# Altium schematic sheet TOP.SchDoc: TOP.SchDoc
size A4; Organization: Queen's Formula SAE; Address1: 130 Stuart St; Address2: Kingston K7L 2V9; Address3: Ontario; Address4: Canada; DocumentNumber: 1; Revision: 0; SheetNumber: 1; SheetTotal: 1
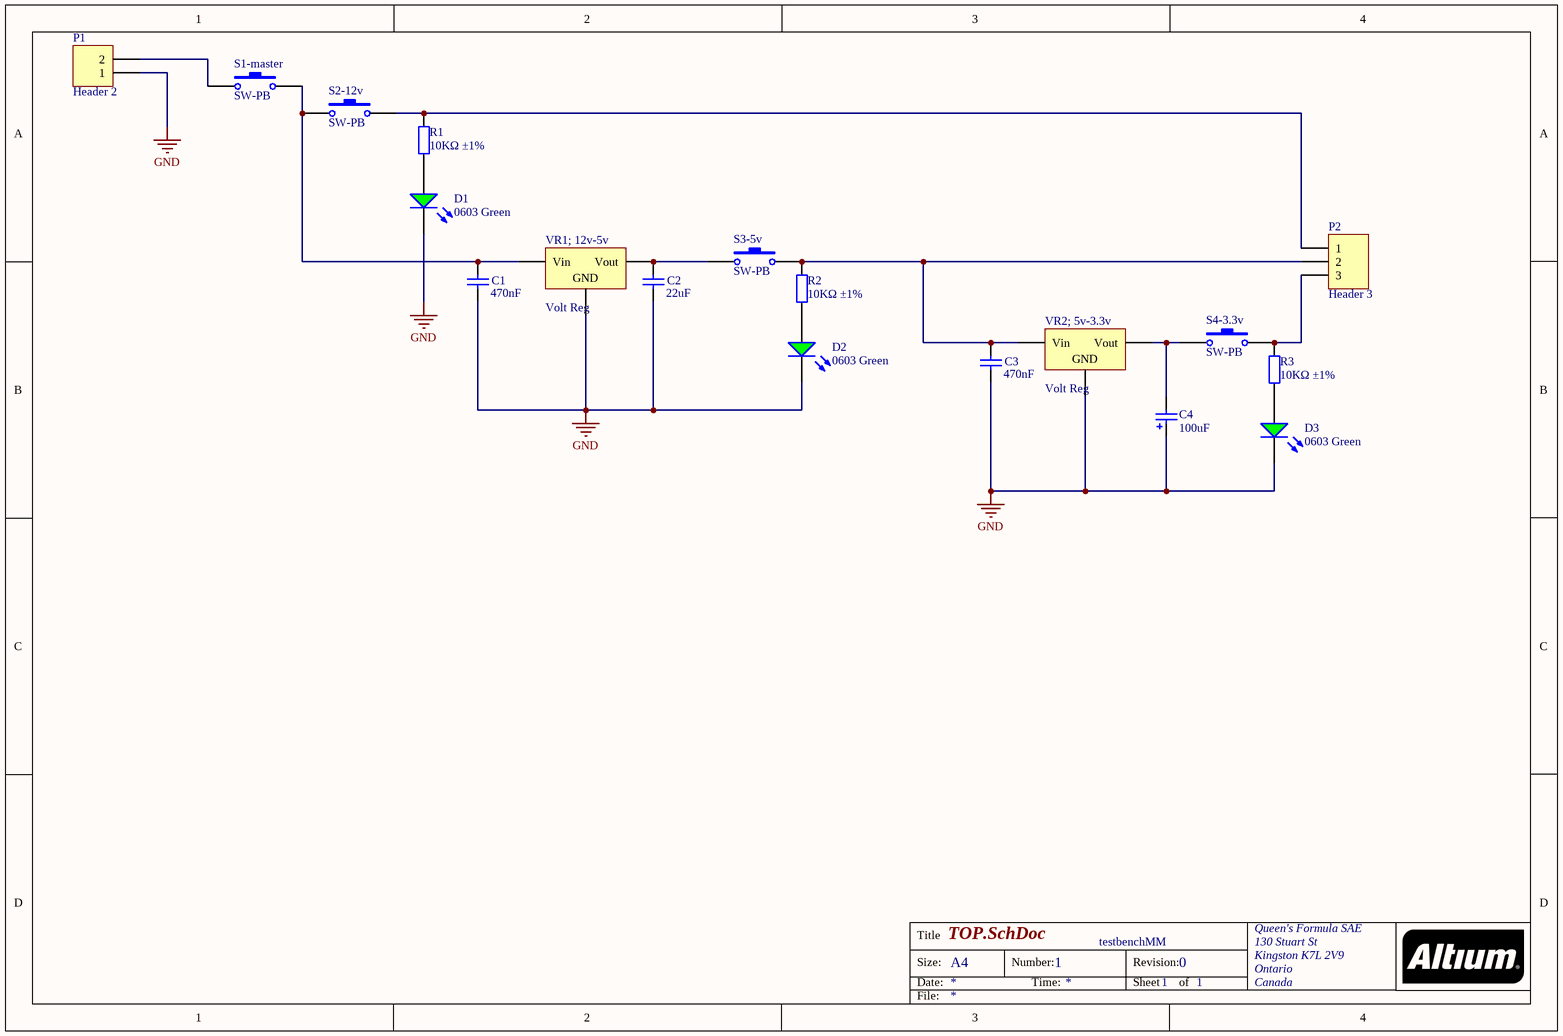
[diagram p0: TOP.SchDoc]

## Parts
C1  470nF  [0805_C]
C2  22uF  [0805_C]
C3  470nF  [0805_C]
C4  100uF  [CASE-B_3528]
D1  0603 Green  [0603_LED_S1]
D2  0603 Green  [0603_LED_S1]
D3  0603 Green  [0603_LED_S1]
P1  Header 2  [HDR1X2]
P2  Header 3  [HDR1X3]
R1  10KΩ ±1%  [0603_R]
R2  10KΩ ±1%  [0603_R]
R3  10KΩ ±1%  [0603_R]
S1-master  SW-PB  [SPST-2]
S2-12v  SW-PB  [SPST-2]
S3-5v  SW-PB  [SPST-2]
S4-3.3v  SW-PB  [SPST-2]
VR1;_12v-5v  Volt Reg  [D2PAK_N]
VR2;_5v-3.3v  Volt Reg  [D2PAK_N]

## Nets
GND: C1.2 C2.1 C3.2 C4.1 D1.K D2.K D3.K P1.1 VR1;_12v-5v.2(GND) VR2;_5v-3.3v.2(GND)
NetC1_1: C1.1 S1-master.2 S2-12v.1 VR1;_12v-5v.1(Vin)
NetC2_2: C2.2 S3-5v.1 VR1;_12v-5v.3(Vout)
NetC3_1: C3.1 P2.2 R2.2 S3-5v.2 VR2;_5v-3.3v.1(Vin)
NetC4_2: C4.2 S4-3.3v.1 VR2;_5v-3.3v.3(Vout)
NetD1_A: D1.A R1.1
NetD2_A: D2.A R2.1
NetD3_A: D3.A R3.1
NetP1_2: P1.2 S1-master.1
NetP2_1: P2.1 R1.2 S2-12v.2
NetP2_3: P2.3 R3.2 S4-3.3v.2

## Notes on the sheet
- testbenchMM
- Title
- Size:
- Date:
- A4
- Number:
- Time:
- Revision:
- Sheet
- of
- File:

## Library data of the parts
C1 C3 = 0805 470nF (474) 10% 50V: Chip capacitors; Manufacturer: Samsung Electro-Mechanics; PartNumber: CL21B474KBFNNNE; Tolerance: 10%; Voltage: 50V; ComponentLink1Description: Supplier link; ComponentLink1URL: http://www.szlcsc.com/product/details_14623.html; Package: 0805; Supplier: LC; SuppliersPartNumber: C13967; Capacitance: 470nF
C2 = 0805 22uF (226) 20% 25V: Chip capacitors; Manufacturer: Samsung Electro-Mechanics; PartNumber: CL21A226MAQNNNE; Tolerance: 20%; Voltage: 25V; ComponentLink1Description: Supplier link; ComponentLink1URL: http://www.szlcsc.com/product/details_46786.html; Package: 0805; Supplier: LC; SuppliersPartNumber: C45783; Capacitance: 22uF
C4 = 3528 100uF (107) 10% 6.3V: Tantalum capacitor; Manufacturer: AVX; PartNumber: TAJB107K006RNJ; Tolerance: 10%; Voltage: 6.3V; ComponentLink1Description: Supplier link; ComponentLink1URL: http://www.szlcsc.com/product/details_16815.html; Package: 3528; Supplier: LC; SuppliersPartNumber: C16133; Capacitance: 100uF
D1-D3 = 0603 LED Green: LED; ComponentLink1Description: 供应商链接; ComponentLink1URL: http://www.szlcsc.com/product/details_73152.html; Package: 0603; Supplier: LC; SuppliersPartNumber: C72043; Color: Green
P1 = Header 2: Header, 2-Pin; LatestRevisionDate: 17-Jul-2002; LatestRevisionNote: Re-released for DXP Platform.; Publisher: Altium Limited
P2 = Header 3: Header, 3-Pin; LatestRevisionDate: 17-Jul-2002; LatestRevisionNote: Re-released for DXP Platform.; Publisher: Altium Limited
R1-R3 = 0603 10K (1002) 1%: Chip resistor; Manufacturer: Uniroyal Elec; PartNumber: 0603WAF1002T5E; Power: 1/10W; ComponentLink1Description: Supplier link; ComponentLink1URL: http://www.szlcsc.com/product/details_26547.html; Package: 0603; Supplier: LC; SuppliersPartNumber: C25804; Resistance: 10KΩ; Tolerance: 1%
S1-master S2-12v S3-5v S4-3.3v = SW-PB: Switch; Published: 24-Mar-1999; LatestRevisionDate: 17-Jul-2002; LatestRevisionNote: Re-released for DXP Platform.; PackageReference: SPST-2; Publisher: Altium Limited; PackageDescription: Switch; 2 Leads
VR1;_12v-5v VR2;_5v-3.3v = Volt Reg: Voltage Regulator; Published: 24-Mar-1999; LatestRevisionDate: 29-May-2009; LatestRevisionNote: IPC-7351 Footprint Added.; PackageReference: D2PAK; Publisher: Altium Limited; PackageDescription: 3-Pin Transistor Outline Package 2.54 mm Pitch, 15.1 mm Lead Span